# Altium schematic sheet Gastroscopy-Controller_Button.SchDoc: Buttons
size 279 x 215 mm; Date: not used; ApprovedBy: not used; CheckedBy: not used; Author: not used; DrawnBy: not used; Organization: not used; Address4: not used; SheetNumber: 5; SheetTotal: 8; Time: not used; ImagePath: not used; Application_BuildNumber: not used
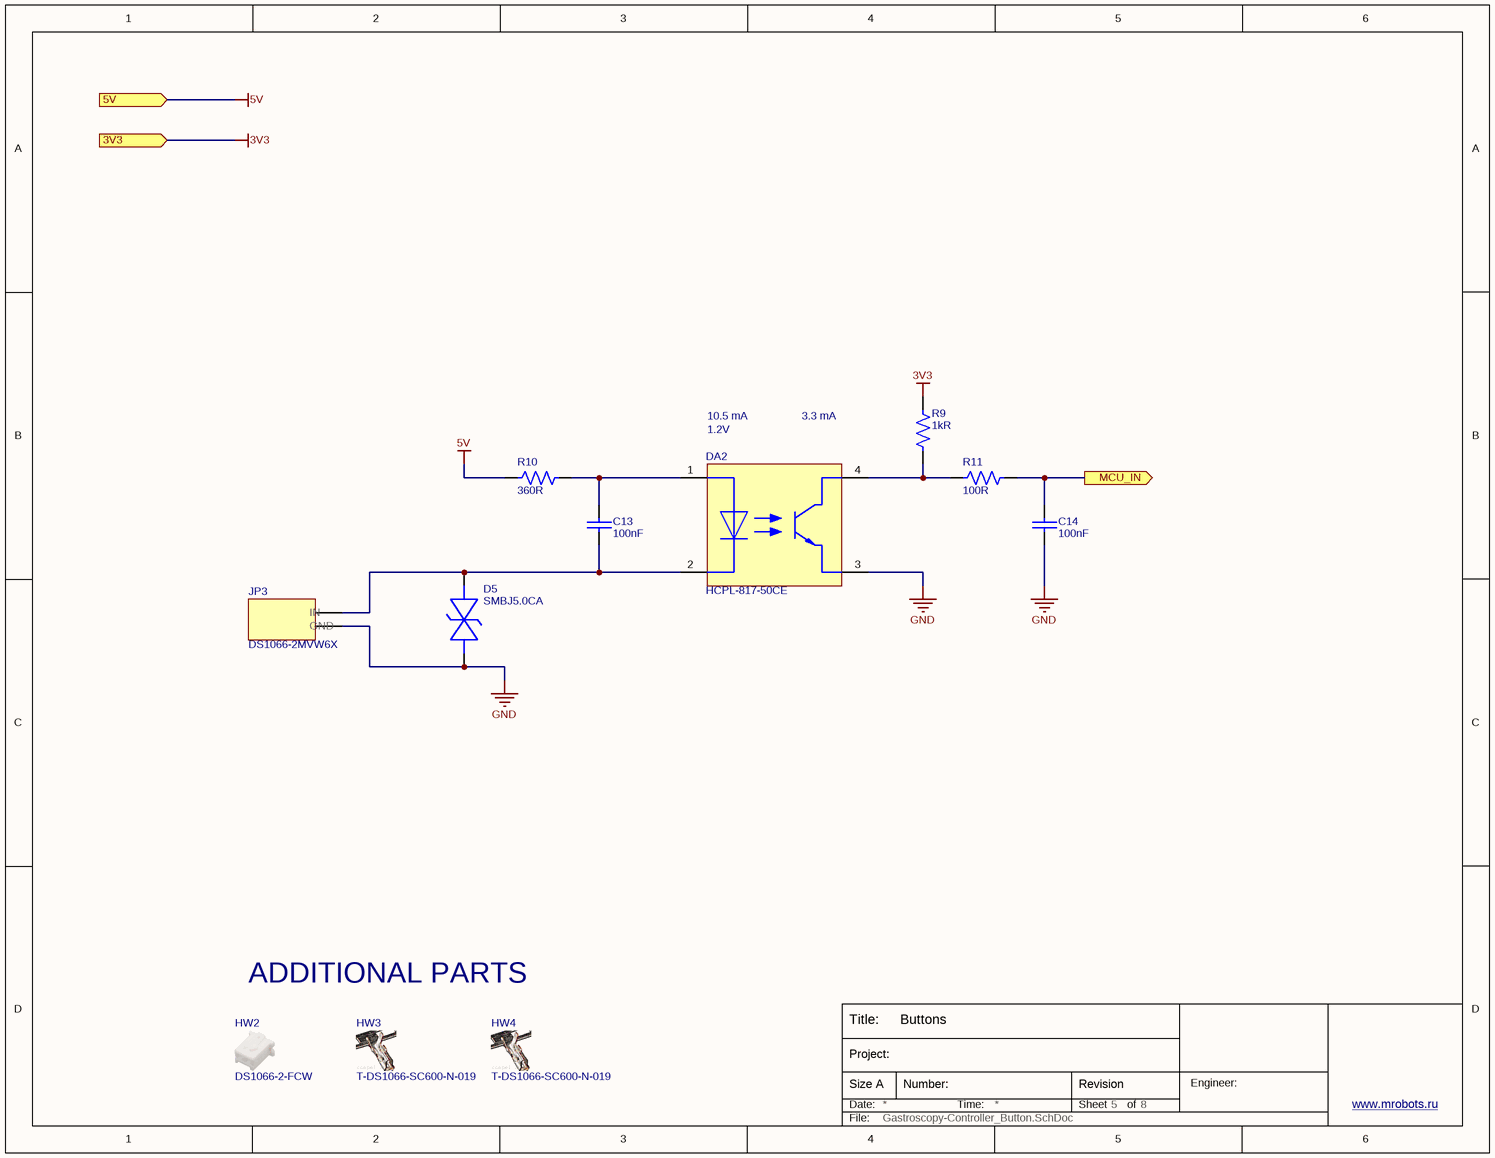
[diagram p0: Gastroscopy-Controller_Button.SchDoc]

## Parts
C13  100nF  [CAP_0603]
C14  100nF  [CAP_0603]
D5  SMBJ5.0CA  [SMB-BIDIR]
DA2  HCPL-817-50CE  [HCPL-817-50CE]
HW2  DS1066-2-FCW  (mechanical)
HW3  T-DS1066-SC600-N-019  (mechanical)
HW4  T-DS1066-SC600-N-019  (mechanical)
JP3  DS1066-2MVW6X  [DS1066-2MVW6X]
R9  1kR  [RES_0603]
R10  360R  [RES_0603]
R11  100R  [RES_0603]

## Ports
3V3 (in), 5V (in), MCU_IN (out)

## Nets
3V3: R9.1 ; port 3V3
5V: R10.1 ; port 5V
GND: C14.2 D5.2 DA2.3(EMITTER) JP3.2
MCU_IN: C14.1 R11.1 ; port MCU_IN
NetC13_1: C13.1 DA2.1(ANODE) R10.2
NetC13_2: C13.2 D5.1 DA2.2(CATHODE) JP3.1
NetDA2_4: DA2.4(COLLECTOR) R9.2 R11.2

## Notes on the sheet
- (near DA2) 1.2V
- 10.5 mA
- 3.3 mA
- ADDITIONAL PARTS
- Title:
- Date:
- Size A
- Project:
- Number:
- Time:
- Sheet
- Revision
- of
- Engineer:
- www.mrobots.ru <http://mrobots.ru/>
- File:

## Library data of the parts
C13 C14 = CL10B104KB8NNNL: CAP CER 0.1UF 50V X7R 0603; Manufacturer 1: Samsung; Tolerance: 10%; Supplier 1: Digi-Key; Manufacturer Part Number 1: CL10B104KB8NNNL; RoHS: Yes; Category: Ceramic Capacitors; Stock 1: 2348404; Pricing 1: 15000=0,00532, 30000=0,00506 (USD); Mount: Surface Mount; Case/Package: 0603; Min Operating Temperature: -55°C; Max Operating Temperature: 125°C; Capacitance: 100nF; Packaging: Tape and Reel; Package Quantity: 15000; Voltage Rating: 50V; Dielectric: X7R; Voltage Rating (DC): 50V; Series: CL; Construction: Flat; Length: 1.6mm; Width: 0.031inch; Height: 0.8mm; Thickness: 0.035inch; Depth: 0.8mm; Radiation Hardening: No; RoHS Compliant: Yes; ComponentLink1URL: https://datasheet.ciiva.com/26838/getdatasheetpartid-357523-26838415.pdf?src-supplier=Verical; ComponentLink1Description: https://datasheet.ciiva.com/26838/getdatasheetpartid-357523-26838415.pdf?src-supplier=Verical; ComponentLink2URL: https://datasheet.ciiva.com/25741/cl10b104kb8nnnl-25741341.pdf?src-supplier=Digi-Key; ComponentLink2Description: https://datasheet.ciiva.com/25741/cl10b104kb8nnnl-25741341.pdf?src-supplier=Digi-Key; Supplier Part Number 1: 1276-CL10B104KB8NNNLTR-ND
D5 = SMBJ5.0CA: TVS DIODE 5VWM 9.2VC SMB; Manufacturer 1: Bourns; Direction: Bidirectional; Max Surge Current: 100A; Reverse Breakdown Voltage: 6.4V; Reverse Standoff Voltage: 5V; Clamping Voltage: 9.2V; Peak Pulse Power: 600W; Breakdown Voltage: 7.25V; Max Reverse Leakage Current: 1.6mA; Test Current: 10mA; Number of Elements: 1; Peak Pulse Current: 65.2A; Element Configuration: Single; Diode Type: ZENER; Operating Supply Voltage: 3.5V; Power Line Protection: No; Supplier 1: Arrow Electronics; RoHS: Yes; Category: TVS Diodes; Stock 1: 3000; Pricing 1: 3000=0,10850, 6000=0,10460, 15000=0,10360, 30000=0,10260 (USD); Mount: Surface Mount; Case/Package: DO-214AA; Number of Pins: 2; Min Operating Temperature: -55°C; Max Operating Temperature: 150°C; Packaging: Tape and Reel; Package Quantity: 1; Min Breakdown Voltage: 6.4V; Polarity: Bidirectional; Termination: SMD/SMT; Max Breakdown Voltage: 7.25V; Leakage Current: 1.6mA; Series: SMBJ; Number of Bidirectional Channels: 1; Number of Channels: 1; Max Power Dissipation: 600W; Resistor Type: Zener; Radiation Hardening: No; RoHS Compliant: Yes; REACH SVHC: No SVHC; ComponentLink1URL: https://datasheet.ciiva.com/334/smbj-334706.pdf?src-supplier=Digi-Key; ComponentLink1Description: https://datasheet.ciiva.com/334/smbj-334706.pdf?src-supplier=Digi-Key; ComponentLink2URL: https://datasheet.ciiva.com/3022/smbj-3022578.pdf?src-supplier=Avnet; ComponentLink2Description: https://datasheet.ciiva.com/3022/smbj-3022578.pdf?src-supplier=Avnet; ComponentLink3URL: https://datasheet.ciiva.com/334/smbj-334707.pdf?src-supplier=Digi-Key; ComponentLink3Description: https://datasheet.ciiva.com/334/smbj-334707.pdf?src-supplier=Digi-Key; ComponentLink4URL: https://datasheet.ciiva.com/334/smbj-334708.pdf?src-supplier=Digi-Key; ComponentLink4Description: https://datasheet.ciiva.com/334/smbj-334708.pdf?src-supplier=Digi-Key; ComponentLink5URL: https://datasheet.ciiva.com/28410/1677318-28410120.pdf?src-supplier=Element14; ComponentLink5Description: https://datasheet.ciiva.com/28410/1677318-28410120.pdf?src-supplier=Element14; ComponentLink6URL: https://datasheet.ciiva.com/8031/1677318-8031161.pdf?src-supplier=Element14; ComponentLink6Description: https://datasheet.ciiva.com/8031/1677318-8031161.pdf?src-supplier=Element14; ComponentLink7URL: https://datasheet.ciiva.com/30104/smbj-30104446.pdf?src-supplier=Onlinecomponents.com; ComponentLink7Description: https://datasheet.ciiva.com/30104/smbj-30104446.pdf?src-supplier=Onlinecomponents.com; Supplier Part Number 1: SMBJ5.0CA; Manufacturer Part Number 1: SMBJ5.0CA
DA2 = HCPL-817-50CE: OPTOISOLATOR 5KV TRANSISTOR 4SMD; Manufacturer 1: Broadcom Avago; Reverse Breakdown Voltage: 6V; Forward Voltage: 1.2V; Forward Current: 50mA; Rise Time: 18000ns; Max Power Dissipation: 200mW; Number of Channels: 1; Collector Emitter Voltage (VCEO): 35V; Collector Emitter Saturation Voltage: 200mV; Max Output Voltage: 70V; Current Transfer Ratio: 400%; Input Current: 20mA; Input Type: DC; Approvals: UL; Supplier 1: Mouser; RoHS: Yes; Category: Optocouplers; Stock 1: 53747; Pricing 1: 1=0,55000, 10=0,35900, 50=0,35900, 100=0,23700, 1000=0,18200, 10000=0,15000 (USD); Mount: Surface Mount; Case/Package: SMD/SMT; Number of Pins: 4; Min Operating Temperature: -30°C; Max Operating Temperature: 100°C; Package Quantity: 1000; Packaging: Tape and Reel; Max Collector Current: 50mA; Output Current per Channel: 50mA; Number of Elements: 1; Power Dissipation: 200mW; Fall Time: 18000ns; Max Input Current: 50mA; Collector Emitter Breakdown Voltage: 70V; Isolation Voltage: 5kV; Number of Circuits: 1; Output Voltage: 70V; Series: -; Collector-emitter Voltage-Max: 200mV; Lead Free: Lead Free; RoHS Compliant: Yes; ComponentLink1URL: https://datasheet.ciiva.com/32424/hcpl-817-00ae-eng-tds-32424469.pdf?src-supplier=Distrelec; ComponentLink1Description: https://datasheet.ciiva.com/32424/hcpl-817-00ae-eng-tds-32424469.pdf?src-supplier=Distrelec; ComponentLink2URL: https://datasheet.ciiva.com/4702/v02-0265en-106799-4702156.pdf?src-supplier=Mouser; ComponentLink2Description: https://datasheet.ciiva.com/4702/v02-0265en-106799-4702156.pdf?src-supplier=Mouser; Supplier Part Number 1: 630-HCPL-817-50CE; Manufacturer Part Number 1: HCPL-817-50CE
HW2 = DS1066-2-FCW: CONN SOCKET 2POS 2MM; Manufacturer 1: Connfly electronic (Zhenqin); Manufacturer Part Number 1: DS1066-2-FCW
HW3 HW4 = T-DS1066-SC600-N-019: СONNECTOR DS1066; Manufacturer 1: Connfly electronic (Zhenqin); Manufacturer Part Number 1: T-DS1066-SC600-N-019
JP3 = DS1066-2MVW6X: CONN HEADER 2POS 2MM; Manufacturer 1: Connfly electronic (Zhenqin); Contact_1: IN; Contact_2: GND; Manufacturer Part Number 1: DS1066-2MVW6X
R9 = RC0603FR-071KL: RES 1K OHM 1% 1/10W 0603; Manufacturer 1: Yageo; Temperature Coefficient: 100ppm/°C; Power Rating: 100mW; Voltage Rating: 50V; Supplier 1: Arrow Electronics; Manufacturer Part Number 1: RC0603FR-071KL; RoHS: Yes; Category: Chip SMD Resistors; Stock 1: 480000; Pricing 1: 5000=0,00240, 10000=0,00230, 25000=0,00220, 125000=0,00190 (USD); Case/Package: 0603; Contact Plating: Tin,Matte; Case Code (Imperial): 0603; Case Code (Metric): 1608; Size Code: 0603; Min Operating Temperature: -55°C; Max Operating Temperature: 155°C; Tolerance: 1%; Resistance: 1kR; Packaging: Tape and Reel; Resistor Type: Thick Film; Termination: SMD/SMT; Features: Moisture Resistant; Series: RC; Max Power Dissipation: 100mW; Number of Terminations: 2; Technology: THICK FILM; Resistance Tolerance: 1%; Construction: Rectangular; Length: 1.6mm; Height: 0.45mm; Depth: 0.8mm; Radiation Hardening: No; REACH SVHC: No SVHC; Lead Free: Lead Free; Military Standard: Not; RoHS Compliant: Yes; Supplier Part Number 1: RC0603FR-071KL
R10 = RC0603FR-07360RL: RES 360 OHM 1% 1/10W 0603; Manufacturer 1: Yageo; Power Rating: 100mW; Voltage Rating: 50V; Temperature Coefficient: 100ppm/°C; Supplier 1: Arrow Electronics; RoHS: Yes; Category: Chip SMD Resistors; Stock 1: 7884; Pricing 1: 1=0,05320, 10=0,01120, 100=0,00760, 250=0,00660, 1000=0,00380, 3000=0,00370, 6000=0,00230 (USD); Case/Package: 0603; Case Code (Metric): 1608; Case Code (Imperial): 0603; Size Code: 0603; Min Operating Temperature: -55°C; Max Operating Temperature: 155°C; Packaging: Tape and Reel; Resistance: 360R; Tolerance: 1%; Package Quantity: 1; Resistor Type: Thick Film; Number of Terminations: 2; Termination: SMD/SMT; Max Power Dissipation: 100mW; Voltage Rating (DC): 50V; Features: Moisture Resistant; Series: RC; Construction: Rectangular; Length: 1.6mm; Width: 0.031inch; Height: 0.022inch; Depth: 0.8mm; Military Standard: Not; Lead Free: Lead Free; RoHS Compliant: Yes; ComponentLink1URL: https://datasheet.ciiva.com/2454/pyu-r-int-thick-7-2454271.pdf?src-supplier=Digi-Key; ComponentLink1Description: https://datasheet.ciiva.com/2454/pyu-r-int-thick-7-2454271.pdf?src-supplier=Digi-Key; ComponentLink2URL: https://datasheet.ciiva.com/2454/pyu-r-int-thick-7-2454272.pdf?src-supplier=Digi-Key; ComponentLink2Description: https://datasheet.ciiva.com/2454/pyu-r-int-thick-7-2454272.pdf?src-supplier=Digi-Key; ComponentLink3URL: https://datasheet.ciiva.com/2454/pyu-r-int-thick-7-2454270.pdf?src-supplier=Digi-Key; ComponentLink3Description: https://datasheet.ciiva.com/2454/pyu-r-int-thick-7-2454270.pdf?src-supplier=Digi-Key; ComponentLink4URL: https://datasheet.ciiva.com/12558/rc0603-272842-12558645.pdf?src-supplier=Mouser; ComponentLink4Description: https://datasheet.ciiva.com/12558/rc0603-272842-12558645.pdf?src-supplier=Mouser; Supplier Part Number 1: RC0603FR-07360RL; Manufacturer Part Number 1: RC0603FR-07360RL
R11 = RC0603FR-07100RL: RES 100 OHM 1% 1/10W 0603; Manufacturer 1: Yageo; Voltage Rating (DC): 50V; Temperature Coefficient: 100ppm/°C; Power Rating: 100mW; Supplier 1: Arrow Electronics; RoHS: Yes; Category: Chip SMD Resistors; Stock 1: 17580000; Pricing 1: 5000=0,00180 (USD); Case/Package: 0603; Number of Pins: 2; Case Code (Imperial): 0603; Case Code (Metric): 1608; Size Code: 0603; Min Operating Temperature: -55°C; Max Operating Temperature: 155°C; Resistance: 100R; Tolerance: 1%; Packaging: Tape and Reel; Resistor Type: Thick Film; Voltage Rating: 50V; Termination: SMD/SMT; Features: Moisture Resistant; Series: RC; Max Power Dissipation: 100mW; Number of Terminations: 2; Construction: Rectangular; Resistance Tolerance: 1%; Technology: THICK FILM; Length: 1.6mm; Width: 0.8mm; Height: 0.45mm; Depth: 0.8mm; REACH SVHC: Unknown; Lead Free: Lead Free; Military Standard: Not; RoHS Compliant: Yes; Supplier Part Number 1: RC0603FR-07100RL; Manufacturer Part Number 1: RC0603FR-07100RL